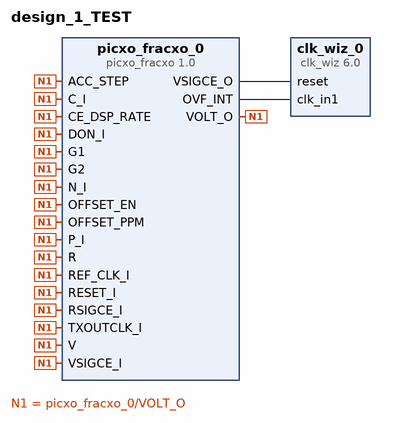
[diagram p0: block diagram of the top level]
# Vivado block design design_1_TEST, xczu19eg-ffve1924-1-e, Vivado 2019.1
create_bd_design design_1_TEST

create_bd_cell -type ip -vlnv xilinx.com:ip:clk_wiz:6.0 clk_wiz_0
create_bd_cell -type ip -vlnv xilinx.com:ip:picxo_fracxo:1.0 picxo_fracxo_0

# ---- connections ----

connect_bd_net [get_bd_pins picxo_fracxo_0/VSIGCE_O] [get_bd_pins clk_wiz_0/reset]
connect_bd_net [get_bd_pins picxo_fracxo_0/OVF_INT] [get_bd_pins clk_wiz_0/clk_in1]
connect_bd_net [get_bd_pins picxo_fracxo_0/VOLT_O] \
  [get_bd_pins picxo_fracxo_0/RESET_I] [get_bd_pins picxo_fracxo_0/REF_CLK_I] [get_bd_pins picxo_fracxo_0/TXOUTCLK_I] \
  [get_bd_pins picxo_fracxo_0/RSIGCE_I] [get_bd_pins picxo_fracxo_0/VSIGCE_I] [get_bd_pins picxo_fracxo_0/ACC_STEP] \
  [get_bd_pins picxo_fracxo_0/G1] [get_bd_pins picxo_fracxo_0/G2] [get_bd_pins picxo_fracxo_0/R] \
  [get_bd_pins picxo_fracxo_0/V] [get_bd_pins picxo_fracxo_0/CE_DSP_RATE] [get_bd_pins picxo_fracxo_0/C_I] \
  [get_bd_pins picxo_fracxo_0/P_I] [get_bd_pins picxo_fracxo_0/N_I] [get_bd_pins picxo_fracxo_0/OFFSET_PPM] \
  [get_bd_pins picxo_fracxo_0/OFFSET_EN] [get_bd_pins picxo_fracxo_0/DON_I]

validate_bd_design
save_bd_design
